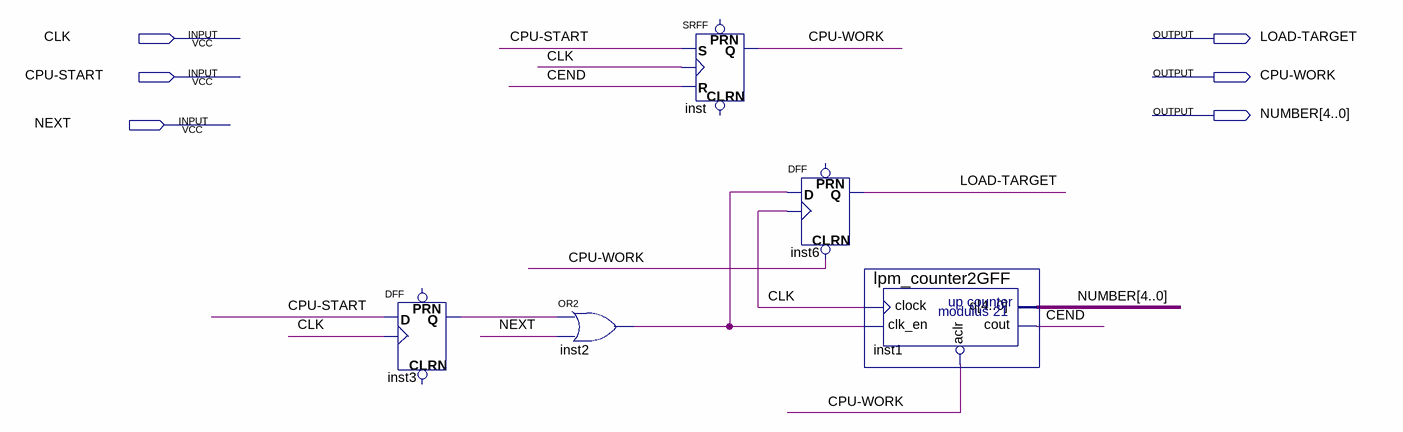
[diagram p0: schematic sheet]
// Quartus schematic VCPU_Controller.bdf as structural Verilog: 5 symbols, 6 pins
module VCPU_Controller (
  input  CLK,
  input  \CPU-START ,
  input  NEXT,
  output \LOAD-TARGET ,
  output \CPU-WORK ,
  output [4:0] NUMBER
);

  wire CEND, inst2_out, inst3_q;

  DFF inst3 (.CLK(CLK), .D(\CPU-START ), .Q(inst3_q));  // open: CLRN, PRN
  or inst2 (inst2_out, inst3_q, NEXT);
  SRFF inst (.S(\CPU-START ), .R(CEND), .CLK(CLK), .Q(\CPU-WORK ));  // open: PRN, CLRN
  DFF inst6 (.CLRN(\CPU-WORK ), .CLK(CLK), .D(inst2_out), .Q(\LOAD-TARGET ));  // open: PRN
  lpm_counter2GFF inst1 (.clock(CLK), .clk_en(inst2_out), .aclr(~\CPU-WORK ), .cout(CEND), .q(NUMBER));
endmodule
